# Altium schematic sheet PowerSupply5V.SchDoc
size A4
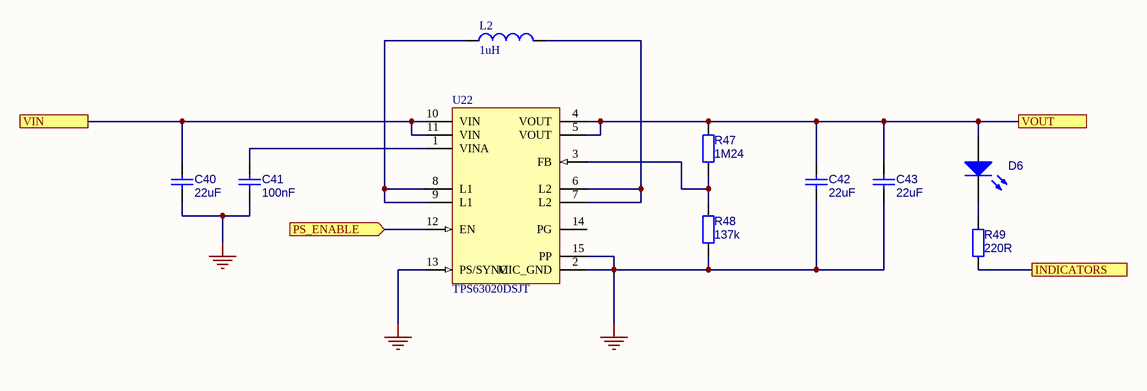
[diagram p0: PowerSupply5V.SchDoc]

## Parts
C40  22uF  [0603_CAP UF HD]
C41  100nF  [0603_CAP UF HD]
C42  22uF  [0603_CAP UF HD]
C43  22uF  [0603_CAP UF HD]
D6  (no value)  [LED 3mm Red]
L2  value 1uH  [252012]  (hidden comment: Inductor)
R47  1M24  [0603-RESISTOR HD]
R48  137k  [0603-RESISTOR HD]
R49  220R  [0603-RESISTOR HD]
U22  TPS63020DSJT  [DSJ14-4000X1580TP_V]

## Ports
INDICATORS, PS_ENABLE (in), VIN, VOUT

## Nets
GND: C40.2 C41.2 C42.2 C43.2 R48.2 U22.2(MIC_GND) U22.13(PS/SYNC) U22.15(PP)
INDICATORS: R49.2 ; port INDICATORS
PS_ENABLE: U22.12(EN) ; port PS_ENABLE
VIN: C40.1 U22.10(VIN) U22.11(VIN) ; port VIN
VOUT: C42.1 C43.1 D6.A R47.1 U22.4(VOUT) U22.5(VOUT) ; port VOUT
NetC41_1: C41.1 U22.1(VINA)
NetD6_K: D6.K R49.1
NetL2_1: L2.1 U22.8(L1) U22.9(L1)
NetL2_2: L2.2 U22.6(L2) U22.7(L2)
NetR47_2: R47.2 R48.1 U22.3(FB)

Not connected (* = marked no-connect by the designer): U22 14(PG)

## Library data of the parts
C40 C42 C43 = Cap: Capacitor; Manufacturer: MuRata; Manufacturer Number: GRM188R60J226MEA0D; Value: 22uF; Digikey Number: 490-7611-1-ND
C41 = Cap: Capacitor; Value: 100nF
D6 = LED: Manufacturer: *; Element 14 Part Number: *; Digikey Number: 732-5005-ND
L2 = Inductor_1: Manufacturer: Samsung Electro-Mechanics; Manufacturer Number: CIGW252010GL1R0MNE; Digikey Number: 1276-6932-1-ND
R47-R49 = Resistor
  R47: Value: 1M24
  R48: Value: 137k
  R49: Value: 220R
U22 = TPS63020DSJ14: High Efficiency Single Inductor Buck-Boost Converter, 4 A, 1.8 to 5.5 V Input, 1.2 to 5.5 V Output, -40 to 85 degC, 14-Pin VSON (DSJ), Green (RoHS & no Sb/Br), Tape and Reel; Manufacturer: Texas Instruments; Manufacturer Number: TPS63020; Digikey Number: 296-27230-1-ND‎